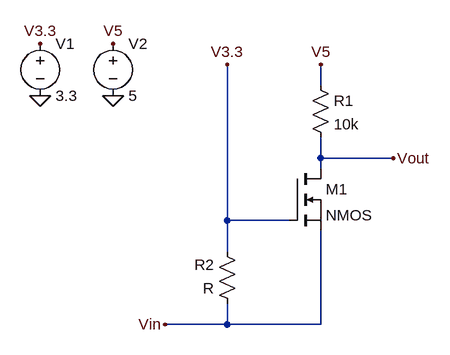
[diagram p0: schematic level-shifter.asc]
level-shifter.asc, the LTspice schematic file:
Version 4
SHEET 1 880 680
WIRE 224 0 224 -32
WIRE 224 112 224 80
WIRE 336 112 224 112
WIRE 224 128 224 112
WIRE 80 208 80 -32
WIRE 176 208 80 208
WIRE 80 256 80 208
WIRE 80 368 80 336
WIRE 80 368 -16 368
WIRE 224 368 224 224
WIRE 224 368 80 368
FLAG -208 16 0
FLAG -96 16 0
FLAG -208 -64 V3.3
FLAG -96 -64 V5
FLAG 80 -32 V3.3
FLAG 224 -32 V5
FLAG 336 112 Vout
FLAG -16 368 Vin
SYMBOL nmos 176 128 R0
SYMATTR InstName M1
SYMBOL res 208 -16 R0
SYMATTR InstName R1
SYMATTR Value 10k
SYMBOL res 96 352 R180
WINDOW 0 36 76 Left 2
WINDOW 3 36 40 Left 2
SYMATTR InstName R2
SYMBOL voltage -208 -80 R0
WINDOW 123 0 0 Left 0
WINDOW 39 0 0 Left 0
SYMATTR InstName V1
SYMATTR Value 3.3
SYMBOL voltage -96 -80 R0
WINDOW 123 0 0 Left 0
WINDOW 39 0 0 Left 0
SYMATTR InstName V2
SYMATTR Value 5

The netlist it stands for:
* level-shifter.asc
M1 Vout V3.3 Vin Vin NMOS
R1 V5 Vout 10k
R2 Vin V3.3 R
V1 V3.3 0 3.3
V2 V5 0 5
.model NMOS NMOS
.model PMOS PMOS
.lib standard.mos
.backanno
.end